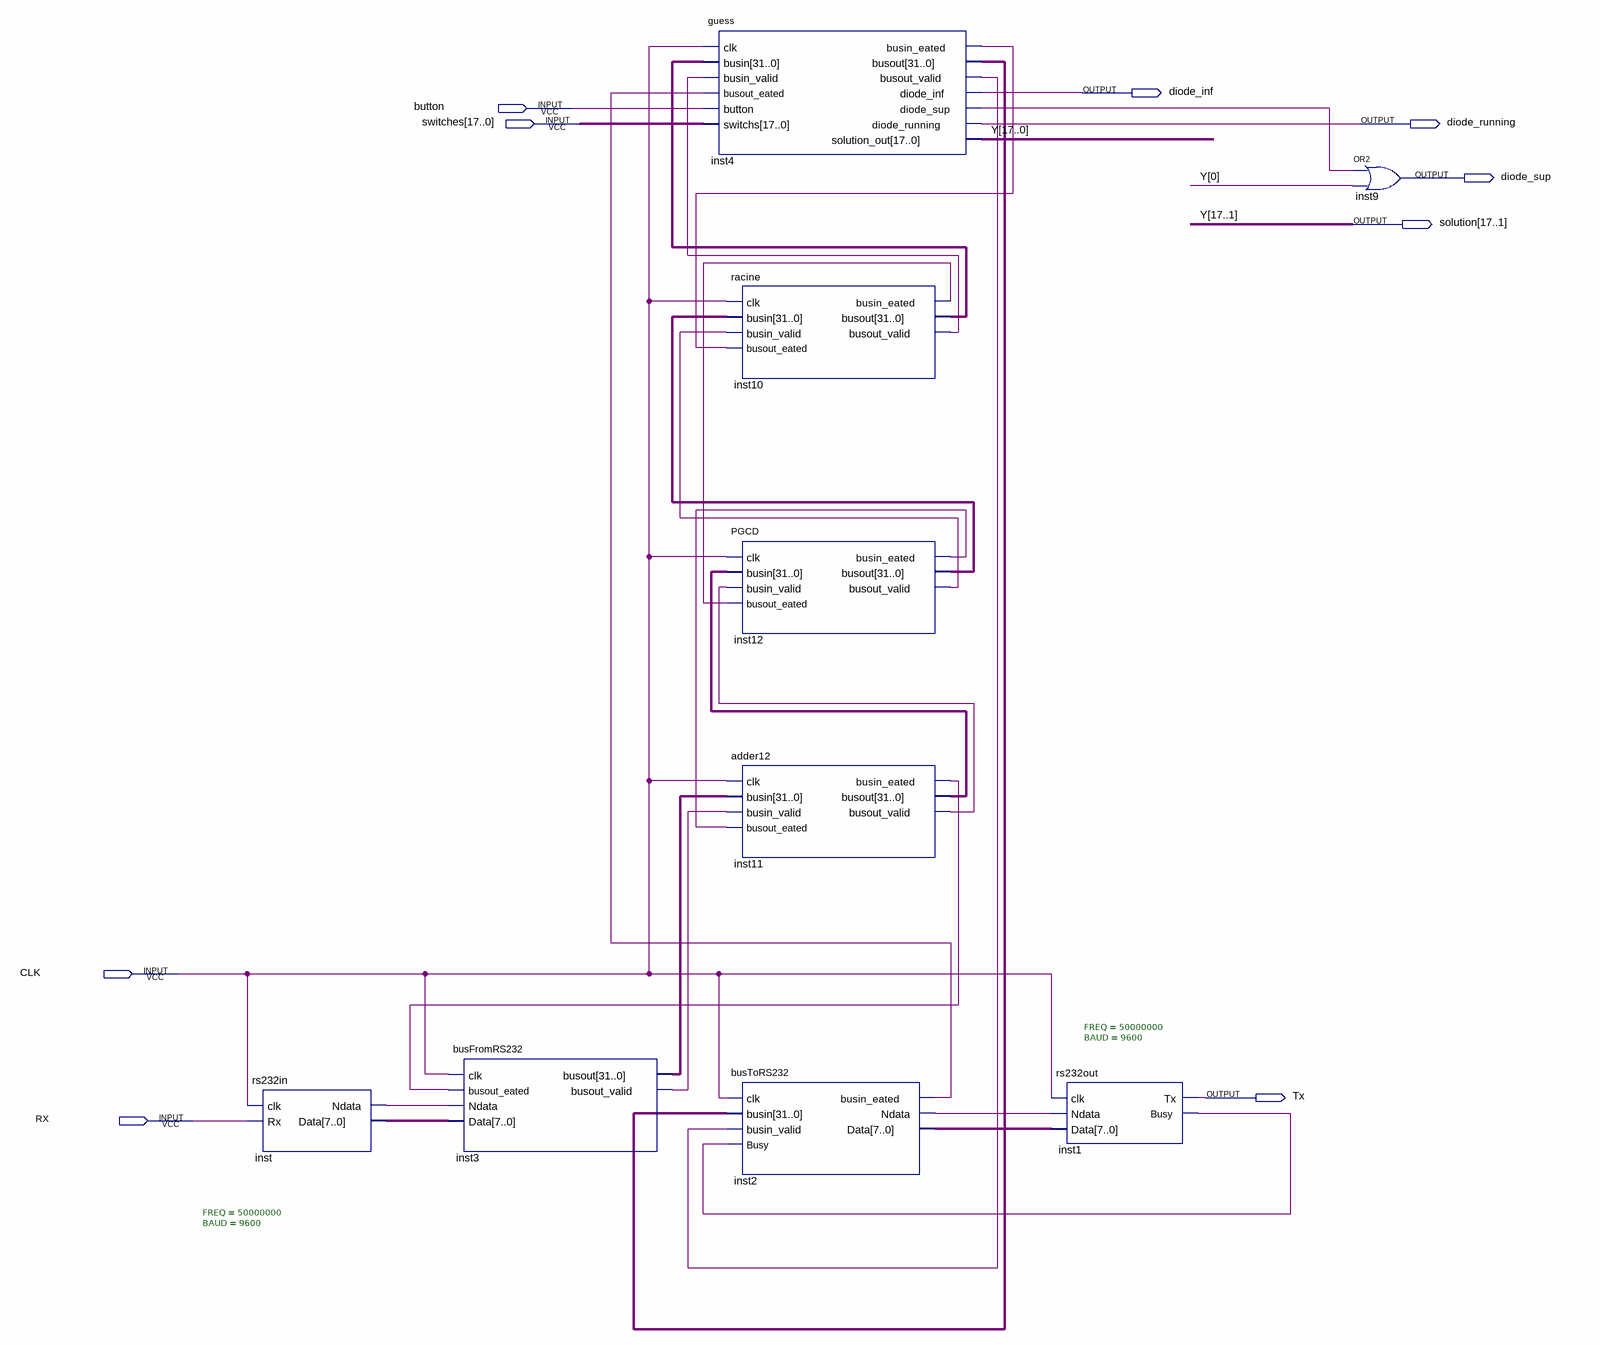
[diagram p0: schematic sheet]
// Quartus schematic Schema.bdf as structural Verilog: 9 symbols, 9 pins
module Schema (
  input  button,
  input  [17:0] switches,
  input  CLK,
  input  RX,
  output diode_inf,
  output diode_running,
  output diode_sup,
  output [17:1] solution,
  output Tx
);

  wire inst1_busy, inst2_busin_eated, inst2_ndata, inst3_busout_valid, inst4_busin_eated, inst4_busout_valid,
       inst4_diode_sup, inst10_busin_eated, inst10_busout_valid, inst11_busin_eated, inst11_busout_valid,
       inst12_busin_eated, inst12_busout_valid, inst_ndata;
  wire [0:0] Y;
  wire [7:0] inst2_data, inst_data;
  wire [31:0] inst3_busout, inst4_busout, inst10_busout, inst11_busout, inst12_busout;

  rs232in #(.FREQ(50000000), .BAUD(9600)) inst (.clk(CLK), .Rx(RX), .Ndata(inst_ndata), .Data(inst_data));
  busFromRS232 inst3 (
    .clk(CLK), .busout_eated(inst11_busin_eated), .Ndata(inst_ndata), .Data(inst_data),
    .busout(inst3_busout), .busout_valid(inst3_busout_valid));
  guess inst4 (
    .clk(CLK), .busin(inst10_busout), .busin_valid(inst10_busout_valid), .busout_eated(inst2_busin_eated),
    .button(button), .switchs(switches), .busin_eated(inst4_busin_eated), .busout(inst4_busout),
    .busout_valid(inst4_busout_valid), .diode_inf(diode_inf), .diode_sup(inst4_diode_sup),
    .diode_running(diode_running), .solution_out({solution, Y[0]}));
  racine inst10 (
    .clk(CLK), .busin(inst12_busout), .busin_valid(inst12_busout_valid), .busout_eated(inst4_busin_eated),
    .busin_eated(inst10_busin_eated), .busout(inst10_busout), .busout_valid(inst10_busout_valid));
  PGCD inst12 (
    .clk(CLK), .busin(inst11_busout), .busin_valid(inst11_busout_valid), .busout_eated(inst10_busin_eated),
    .busin_eated(inst12_busin_eated), .busout(inst12_busout), .busout_valid(inst12_busout_valid));
  adder12 inst11 (
    .clk(CLK), .busin(inst3_busout), .busin_valid(inst3_busout_valid), .busout_eated(inst12_busin_eated),
    .busin_eated(inst11_busin_eated), .busout(inst11_busout), .busout_valid(inst11_busout_valid));
  busToRS232 inst2 (
    .clk(CLK), .busin(inst4_busout), .busin_valid(inst4_busout_valid), .Busy(inst1_busy),
    .busin_eated(inst2_busin_eated), .Ndata(inst2_ndata), .Data(inst2_data));
  rs232out #(.FREQ(50000000), .BAUD(9600)) inst1 (
    .clk(CLK), .Ndata(inst2_ndata), .Data(inst2_data), .Tx(Tx), .Busy(inst1_busy));
  or inst9 (diode_sup, inst4_diode_sup, Y[0]);

  // Other names for the same wires on the sheet: Y[17:1] = solution
endmodule
